# Altium schematic sheet Processor.SchDoc
size A3; SheetNumber: 1; SheetTotal: 1; PageSetup: Record=PageOptions|CenterHorizontal=True|CenterVertical=True|PrintScale=0.97|XCorrection=1.00|YCorrection=1.00|PrintKind=1|BorderSize=5000000|LeftOffset=0|BottomOffset=0|Orientation=2|PaperLength=2970|PaperWidth=2100|Scale=100|PaperSource=7|PrintQuality=600|MediaType=1|DitherType=10|PaperKind=A4|PrintScaleMode=1
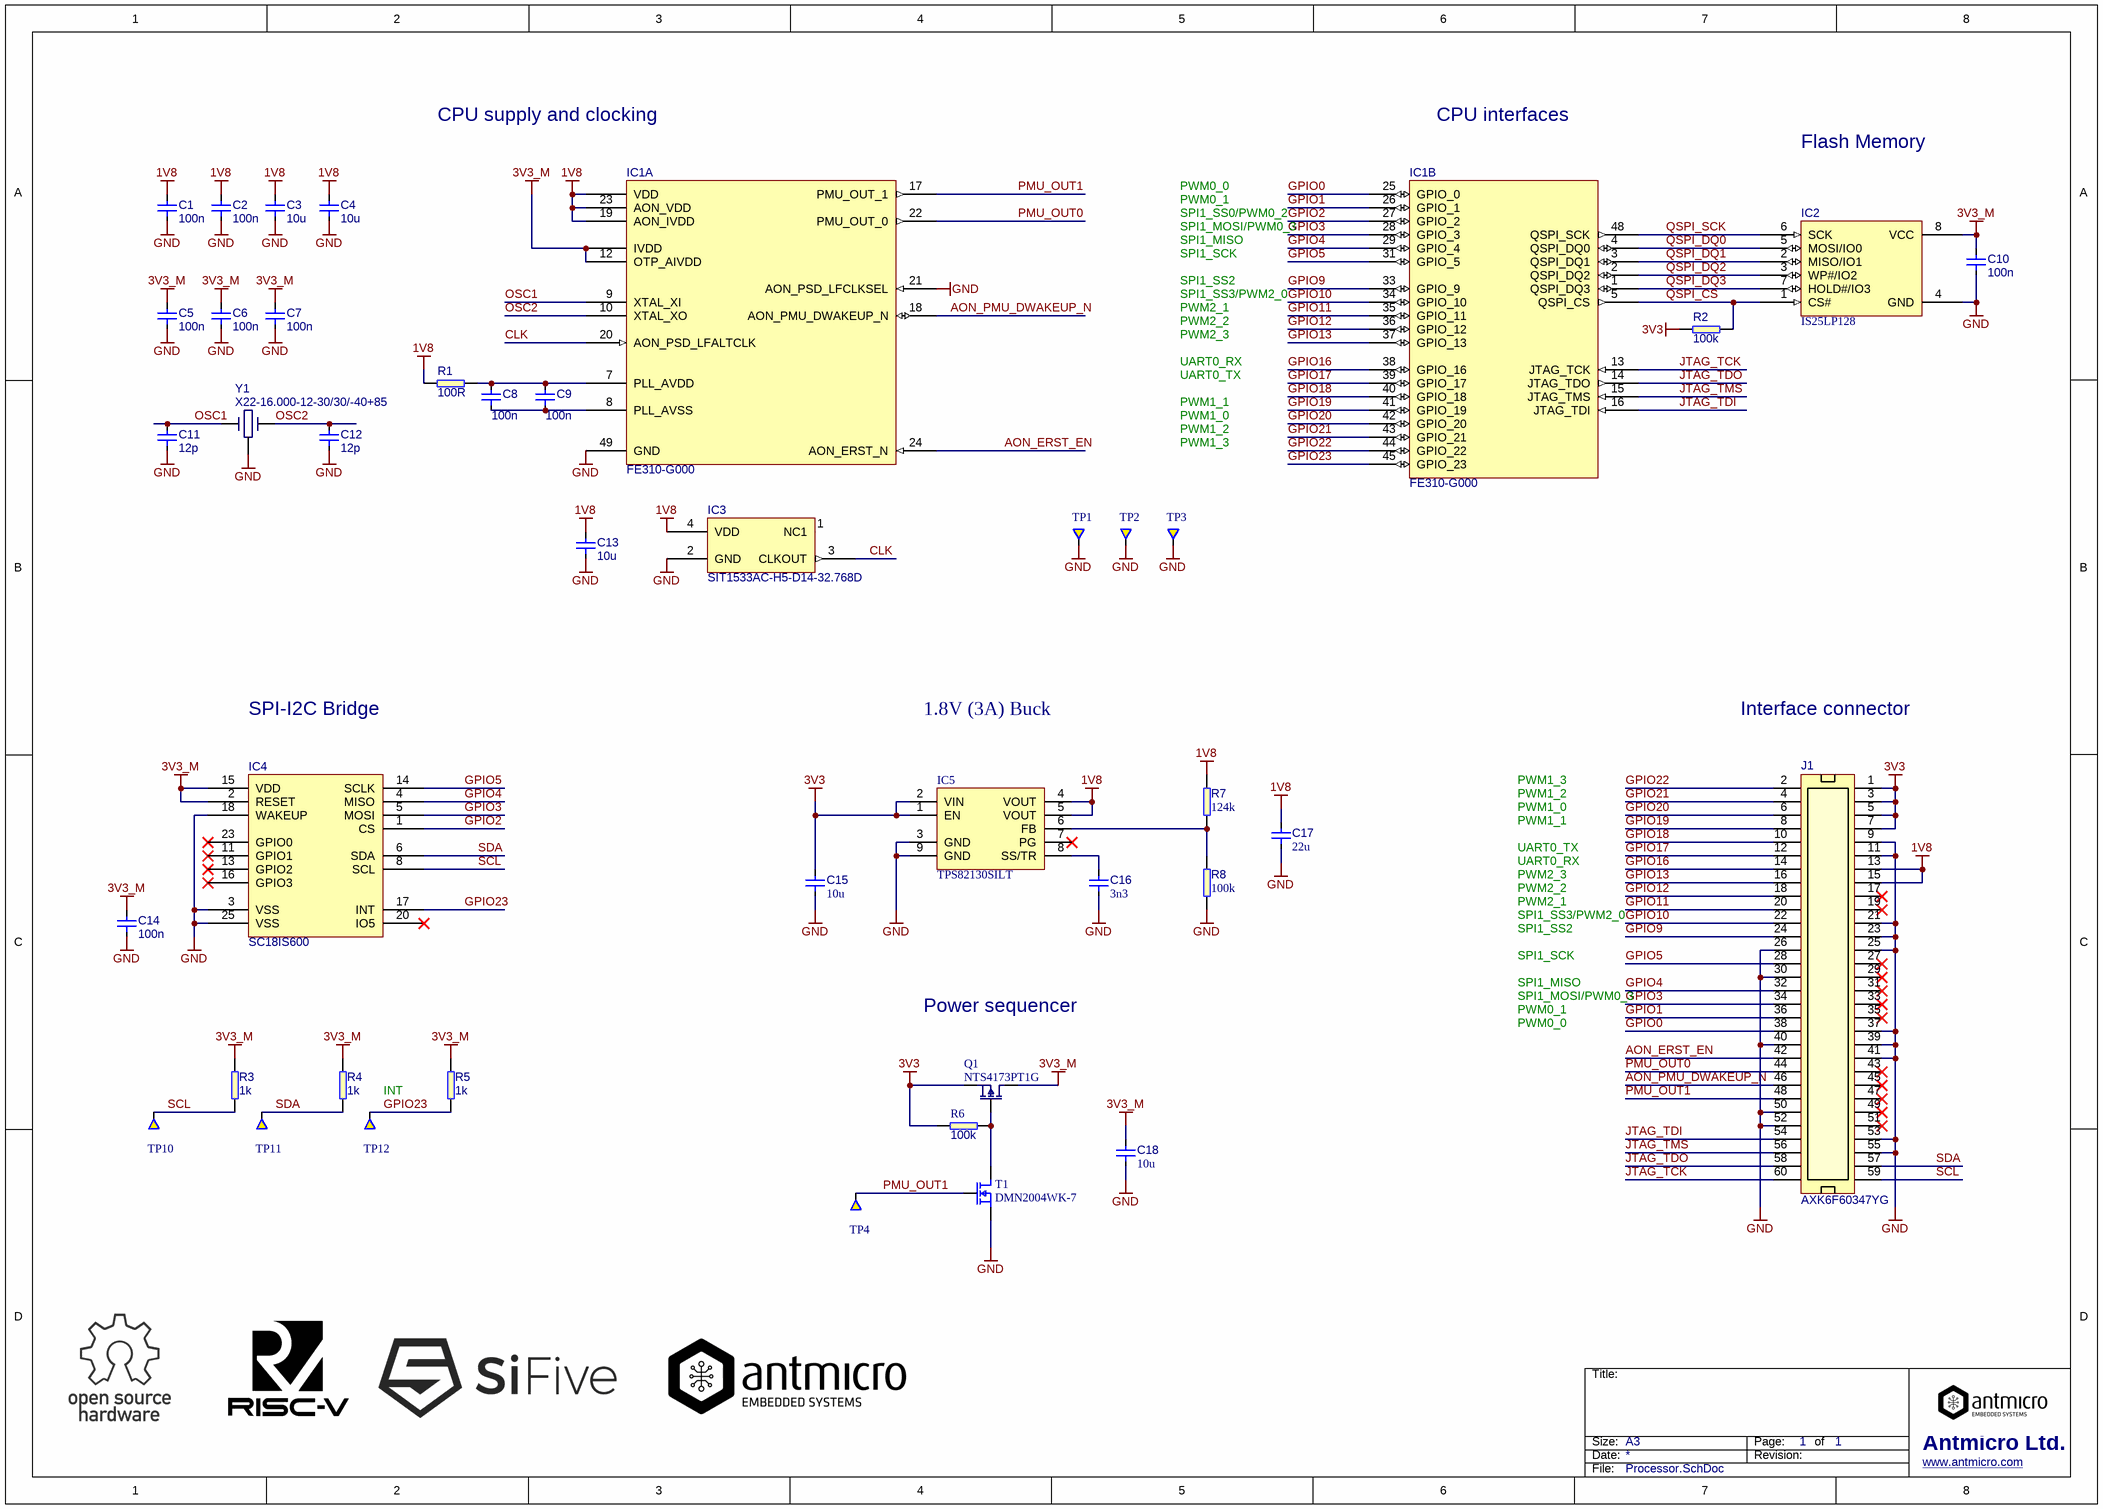
[diagram p0: Processor.SchDoc]

## Parts
C1  100n  [0402]
C2  100n  [0402]
C3  10u  [0402]
C4  10u  [0402]
C5  100n  [0402]
C6  100n  [0402]
C7  100n  [0402]
C8  100n  [0402]
C9  100n  [0402]
C10  100n  [0402]
C11  12p  [0402]
C12  12p  [0402]
C13  10u  [0402]
C14  100n  [0402]
C15  10u  [0402]
C16  3n3  [0402]
C17  22u  [0603]
C18  10u  [0402]
IC1  FE310-G000  [FE310-G000]  (parts A,B of 2)
IC2  IS25LP128  [WSON_6x5mm_8pin]
IC3  SIT1533AC-H5-D14-32.768D  [SIT1533AC]
IC4  SC18IS600  [QFN-24_4X4MM]
IC5  TPS82130SILT  [MicroSIP]
J1  AXK6F60347YG  [AXK6F60347YG]
Q1  NTS4173PT1G  [SC70-3]
R1  100R  [0402]
R2  100k  [0402]
R3  1k  [0402]
R4  1k  [0402]
R5  1k  [0402]
R6  100k  [0402]
R7  124k  [0402]
R8  100k  [0402]
T1  DMN2004WK-7  [SC70-3]
TP1  Testpad  [TP-R-0.7]  (value not drawn)  (no BOM)
TP2  Testpad  [TP-R-0.7]  (value not drawn)  (no BOM)
TP3  Testpad  [TP-R-0.7]  (value not drawn)  (no BOM)
TP4  Testpad  [TP-R-0.7]  (value not drawn)  (no BOM)
TP10  Testpad  [TP-R-0.7]  (value not drawn)  (no BOM)
TP11  Testpad  [TP-R-0.7]  (value not drawn)  (no BOM)
TP12  Testpad  [TP-R-0.7]  (value not drawn)  (no BOM)
Y1  X22-16.000-12-30/30/-40+85  [CRYSTAL_X22_2.5x2mm]

## Nets
1V8: C1.2 C2.2 C3.2 C4.2 C13.2 C17.2 IC1.19(AON_IVDD) IC1.23(AON_VDD) IC1.VDD IC3.4(VDD) IC5.4(VOUT) IC5.5(VOUT) J1.13 J1.15 R1.1 R7.1
3V3: C15.2 IC5.1(EN) IC5.2(VIN) J1.1 J1.3 J1.5 J1.7 Q1.2(S) R2.1 R6.1
3V3_M: C5.2 C6.2 C7.2 C10.2 C14.2 C18.2 IC1.12(OTP_AIVDD) IC1.IVDD IC2.8(VCC) IC4.2(RESET) IC4.15(VDD) Q1.3(D) R3.1 R4.1 R5.1
GND: C1.1 C2.1 C3.1 C4.1 C5.1 C6.1 C7.1 C10.1 C11.1 C12.1 C13.1 C14.1 C15.1 C16.1 C17.1 C18.1 IC1.21(AON_PSD_LFCLKSEL) IC1.49(GND) IC2.4(GND) IC3.2(GND) IC4.3(VSS) IC4.18(WAKEUP) IC4.25(VSS) IC5.3(GND) IC5.9(GND) J1.9 J1.11 J1.21 J1.23 J1.25 J1.26 J1.30 J1.37 J1.39 J1.40 J1.41 J1.50 J1.52 J1.53 J1.55 R8.2 T1.2(S) TP1.1 TP2.1 TP3.1 Y1.GND
AON_ERST_EN: IC1.24(AON_ERST_N) J1.42
AON_PMU_DWAKEUP_N: IC1.18(AON_PMU_DWAKEUP_N) J1.46
CLK: IC1.20(AON_PSD_LFALTCLK) IC3.3(CLKOUT)
GPIO0: IC1.25(GPIO_0) J1.38
GPIO1: IC1.26(GPIO_1) J1.36
GPIO2: IC1.27(GPIO_2) IC4.1(CS)
GPIO3: IC1.28(GPIO_3) IC4.5(MOSI) J1.34
GPIO4: IC1.29(GPIO_4) IC4.4(MISO) J1.32
GPIO5: IC1.31(GPIO_5) IC4.14(SCLK) J1.28
GPIO9: IC1.33(GPIO_9) J1.24
GPIO10: IC1.34(GPIO_10) J1.22
GPIO11: IC1.35(GPIO_11) J1.20
GPIO12: IC1.36(GPIO_12) J1.18
GPIO13: IC1.37(GPIO_13) J1.16
GPIO16: IC1.38(GPIO_16) J1.14
GPIO17: IC1.39(GPIO_17) J1.12
GPIO18: IC1.40(GPIO_18) J1.10
GPIO19: IC1.41(GPIO_19) J1.8
GPIO20: IC1.42(GPIO_20) J1.6
GPIO21: IC1.43(GPIO_21) J1.4
GPIO22: IC1.44(GPIO_22) J1.2
GPIO23: IC1.45(GPIO_23) IC4.17(INT) R5.2 TP12.1
JTAG_TCK: IC1.13(JTAG_TCK) J1.60
JTAG_TDI: IC1.16(JTAG_TDI) J1.54
JTAG_TDO: IC1.14(JTAG_TDO) J1.58
JTAG_TMS: IC1.15(JTAG_TMS) J1.56
OSC1: C11.2 IC1.9(XTAL_XI) Y1.1
OSC2: C12.2 IC1.10(XTAL_XO) Y1.3
PMU_OUT0: IC1.22(PMU_OUT_0) J1.44
PMU_OUT1: IC1.17(PMU_OUT_1) J1.48 T1.1(G) TP4.1
QSPI_CS: IC1.5(QSPI_CS) IC2.1(CS#) R2.2
QSPI_DQ0: IC1.4(QSPI_DQ0) IC2.5(MOSI/IO0)
QSPI_DQ1: IC1.3(QSPI_DQ1) IC2.2(MISO/IO1)
QSPI_DQ2: IC1.2(QSPI_DQ2) IC2.3(WP#/IO2)
QSPI_DQ3: IC1.1(QSPI_DQ3) IC2.7(HOLD#/IO3)
QSPI_SCK: IC1.48(QSPI_SCK) IC2.6(SCK)
SCL: IC4.8(SCL) J1.59 R3.2 TP10.1
SDA: IC4.6(SDA) J1.57 R4.2 TP11.1
NetC8_1: C8.1 C9.1 IC1.8(PLL_AVSS)
NetC8_2: C8.2 C9.2 IC1.7(PLL_AVDD) R1.2
NetC16_2: C16.2 IC5.8(SS/TR)
NetIC5_6: IC5.6(FB) R7.2 R8.1
NetQ1_1: Q1.1(G) R6.2 T1.3(D)

Not connected (* = marked no-connect by the designer): IC3 1(NC1); IC4 11(GPIO1)* 13(GPIO2)* 16(GPIO3)* 20(IO5)* 23(GPIO0)*; IC5 7(PG)*; J1 17* 19* 27* 29* 31* 33* 35* 43* 45* 47* 49* 51*

## Notes on the sheet
- CPU supply and clocking
- CPU interfaces
- Flash Memory
- PWM0_0
- PWM0_1
- SPI1_SS0/PWM0_2
- SPI1_MOSI/PWM0_3
- SPI1_MISO
- SPI1_SCK
- SPI1_SS2
- SPI1_SS3/PWM2_0
- PWM2_1
- PWM2_2
- PWM2_3
- UART0_RX
- UART0_TX
- PWM1_1
- PWM1_0
- PWM1_2
- PWM1_3
- SPI-I2C Bridge
- 1.8V (3A) Buck
- Interface connector
- Power sequencer
- INT
- Title:
- Size:
- Date:
- A3
- Revision:
- Page:
- of
- Antmicro Ltd.
- File:
- www.antmicro.com

## Library data of the parts
C1 C2 C5-C10 C14 = C_100n_0402: MLCC SMT Capacitor 100nF 0402; Manufacturer: MULTICOMP; Part Symbol: MC0402X104M100CT; Part Number: C_100n_0402; Value: 100n
C3 C4 C13 C15 C18 = C_10u_0402: MLCC SMT Capacitor 10uF 0402; Manufacturer: TDK; Part Symbol: C1005X5R0J106M050BC; Part Number: C_10u_0402; Value: 10u
C11 C12 = C_12p_0402: MLCC SMT Capacitor 12pF 0402; Manufacturer: WALSIN; Part Symbol: 0402N120J500CT; Part Number: C_12p_0402; Value: 12p
C16 = C_3n3_0402: MLCC SMT Capacitor 3.3nF 0402; Manufacturer: MULTICOMP; Part Symbol: MC0402B332K250CT; Value: 3n3; Part Number: C_3n3_0402
C17 = C_22_0603: MLCC SMT Capacitor 22uF 0603; Part Number: C_22u_0603; Manufacturer: MURATA; Part Symbol: GRM188R60G226MEA0D; Value: 22u
IC1 = FE310-G000: Manufacturer: FREEDOM; Part Number: FE310-G000; Value: FE310-G000; Part Symbol: FE310-G000
IC2 = IS25LP128: Flash Memory 128Mb QPI/QSPI, WSON, RoHS, ET; Part Number: IS25LP128-JKLE; Manufacturer: ISSI; Value: IS25LP128; Part Symbol: IS25LP128-JKLE
IC3 = SIT1533AC: 32.768kHz LVCMOS MEMS (Silicon) Oscillator Surface Mount 1.2 V ~ 3.63 V 1.3µA; Manufacturer: SiTIME; Part Number: SIT1533AC-H5-D14-32.768D; Value: SIT1533AC-H5-D14-32.768D; Part Symbol: SIT1533AC-H5-D14-32.768D
IC4 = SC18IS600: IC SPI TO I2C BUS 24-HVQFN; Part Number: SC18IS600IBS,151; Manufacturer: NXP; Value: SC18IS600; Part Symbol: SC18IS600IBS,151
IC5 = TPS82130: 3-A 17V STEP-DOWN CONVERTER; Manufacturer: Texas Instruments; Part Number: TPS82130SILT; Value: TPS82130SILT; Part Symbol: TPS82130SILT
J1 = AXK6F60347YG: CONN HEADER BRD/BRD .5MM 60POS; Manufacturer: PANASONIC; Part Number: AXK6F60347YG; Value: AXK6F60347YG; Part Symbol: AXK6F60347YG
Q1 = PMOS: MOSFET P-CH 30V 1.2A SC70-3; Manufacturer: ON Semiconductor; Part Symbol: NTS4173PT1G; Part Number: NTS4173PT1G; Value: NTS4173PT1G
R1 = R_100R_0402: SMT Resistor 100R 0402; Manufacturer: BOURNS; Part Symbol: CR0402-FX-1000GLF; Part Number: R_100R_0402; Value: 100R
R2 R8 = R_100k_0402: SMT Resistor 100k 0402; Manufacturer: VISHAY; Part Symbol: CRCW0402100KFKEDHP; Part Number: R_100k_0402; Value: 100k
R3-R5 = R_1k_0402: SMT Resistor 0402; Manufacturer: MULTICOMP; Part Symbol: MCMR04X1001FTL; Part Number: R_1k_0402; Value: 1k
R6 = R_100k_0402: SMT Resistor 100k 0402; Manufacturer: VISHAY; Part Symbol: CRCW0402100KFKEDHP; Tolerance: 1%; Part Number: R_100k_0402; Value: 100k; Supplier 1: Farnell; Supplier Part Number 1: 1738877
R7 = R_124k_0402: SMT Resistor 124k 0402; Manufacturer: WALSIN; Part Symbol: WR04X1240FTL; Value: 124k; Part Number: R_124k_0402
T1 = NMOS: MOSFET N-CH 20V 540MA SC70-3; Manufacturer: DIODES INC.; Value: DMN2004WK-7; Part Number: DMN2004WK-7; Part Symbol: DMN2004WK-7
TP1-TP4 TP10-TP12 = Testpad: Testpad 1.5mm diameter
Y1 = CRYSTAL_4PIN: MERCURY UNITED ELECTRONICS  X22-16.000-12-30/30/-40+85  Crystal, 16 MHz, SMD, 2.5mm x 2mm, 30 ppm, 12 pF, 30 ppm, X22 Series; Part Number: CRYSTAL_16MHz_SMD_2.5x2mm; Value: X22-16.000-12-30/30/-40+85; Manufacturer: MERCURY UNITED ELECTRONICS; Part Symbol: X22-16.000-12-30/30/-40+85